# EAGLE design C2000 communications dock (EAGLE 9.5.0)
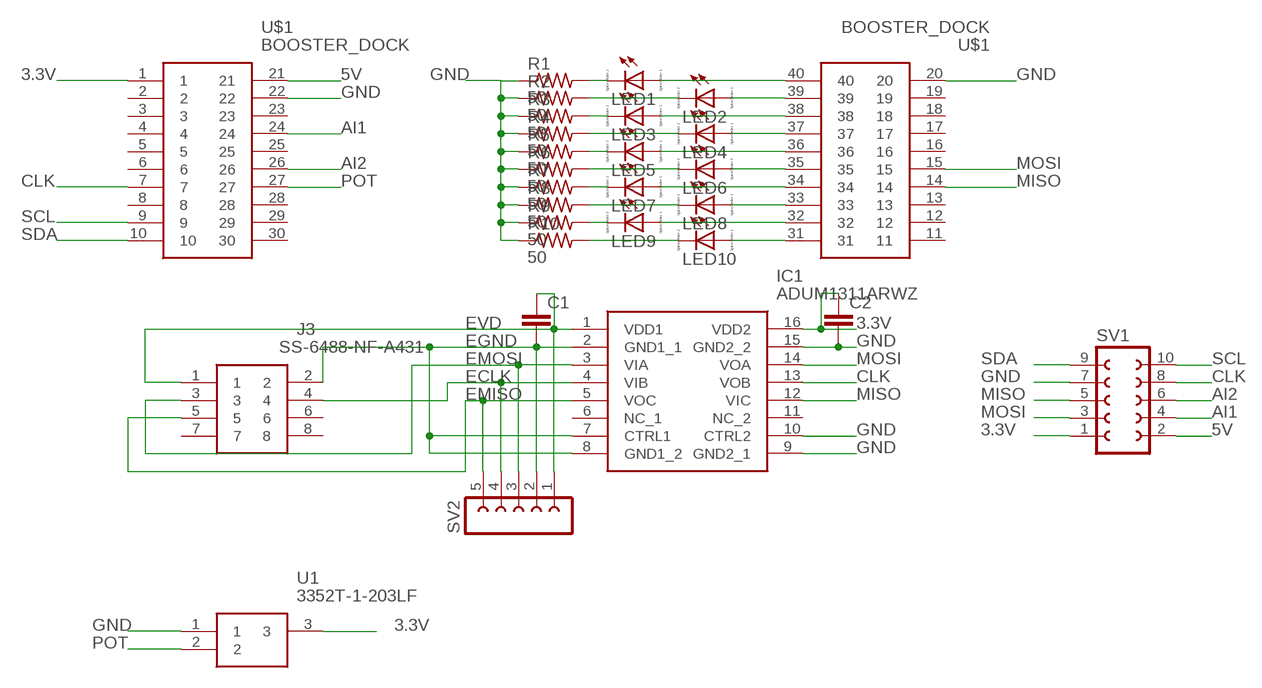
[diagram p0: schematic, sheet 1]

## Parts
C1  C-EUC0603  [C0603]
C2  C-EUC0603  [C0603]
IC1  ADUM1311ARWZ  [SOIC127P1032X265-16N]
J3  SS-6488-NF-A431  [SS6488NFA431]
LED1  LED_ESML0603  [LED_SML0603]
LED2  LED_ESML0603  [LED_SML0603]
LED3  LED_ESML0603  [LED_SML0603]
LED4  LED_ESML0603  [LED_SML0603]
LED5  LED_ESML0603  [LED_SML0603]
LED6  LED_ESML0603  [LED_SML0603]
LED7  LED_ESML0603  [LED_SML0603]
LED8  LED_ESML0603  [LED_SML0603]
LED9  LED_ESML0603  [LED_SML0603]
LED10  LED_ESML0603  [LED_SML0603]
R1  50  R-US_R0603  [R0603]
R2  50  R-US_R0603  [R0603]
R3  50  R-US_R0603  [R0603]
R4  50  R-US_R0603  [R0603]
R5  50  R-US_R0603  [R0603]
R6  50  R-US_R0603  [R0603]
R7  50  R-US_R0603  [R0603]
R8  50  R-US_R0603  [R0603]
R9  50  R-US_R0603  [R0603]
R10  50  R-US_R0603  [R0603]
SV1  FE05-2  [FE05-2]
SV2  FE05-1  [FE05-1]
U1  3352T-1-203LF  [3352T-1-203LF]
U$1  BOOSTER_DOCK  [BOOSTER_DOCK]

## Nets
3.3V: C2.1 IC1.16(VDD2) SV1.1 U1.3 U$1.1
5V: SV1.2 U$1.21
AI1: SV1.4 U$1.24
AI2: SV1.6 U$1.26
CLK: IC1.13(VOB) SV1.8 U$1.7
ECLK: IC1.4(VIB) J3.4 SV2.4
EGND: C1.2 IC1.2(GND1_1) IC1.7(CTRL1) IC1.8(GND1_2) J3.2 SV2.2
EMISO: IC1.5(VOC) J3.5 SV2.5
EMOSI: IC1.3(VIA) J3.3 SV2.3
EVD: C1.1 IC1.1(VDD1) J3.1 SV2.1
GND: C2.2 IC1.9(GND2_1) IC1.10(CTRL2) IC1.15(GND2_2) R1.1 R2.1 R3.1 R4.1 R5.1 R6.1 R7.1 R8.1 R9.1 R10.1 SV1.7 U1.1 U$1.20 U$1.22
MISO: IC1.12(VIC) SV1.5 U$1.14
MOSI: IC1.14(VOA) SV1.3 U$1.15
N$2: LED1.A U$1.40
N$3: LED2.A U$1.39
N$4: LED3.A U$1.38
N$5: LED4.A U$1.37
N$6: LED5.A U$1.36
N$8: LED6.A U$1.35
N$9: LED7.A U$1.34
N$11: LED8.A U$1.33
N$12: LED9.A U$1.32
N$15: LED10.A U$1.31
N$17: LED1.C R1.2
N$18: LED2.C R2.2
N$19: LED3.C R3.2
N$20: LED4.C R4.2
N$21: LED5.C R5.2
N$22: LED6.C R6.2
N$23: LED7.C R7.2
N$24: LED8.C R8.2
N$25: LED9.C R9.2
N$26: LED10.C R10.2
POT: U1.2 U$1.27
SCL: SV1.10 U$1.9
SDA: SV1.9 U$1.10
Unconnected: IC1.6(NC_1) IC1.11(NC_2) J3.6 J3.7 J3.8 U$1.2 U$1.3 U$1.4 U$1.5 U$1.6 U$1.8 U$1.11 U$1.12 U$1.13 U$1.16 U$1.17 U$1.18 U$1.19 U$1.23 U$1.25 U$1.28 U$1.29 U$1.30

## Library data of the parts
C1 C2 = rcl:C-EU: CAPACITOR, European symbol; SPICEPREFIX: C
IC1 = SamacSys_Parts:ADUM1311ARWZ: Analog Devices ADUM1311ARWZ PCB SMT 3-channel Digital Isolator, 2500 Vrms, 16-Pin SOIC Source: Datasheet <https://componentsearchengine.com/Datasheets/1/ADUM1311ARWZ.pdf>; DESCRIPTION: Analog Devices ADUM1311ARWZ PCB SMT 3-channel Digital Isolator, 2500 Vrms, 16-Pin SOIC; HEIGHT: 2.65mm; MANUFACTURER_NAME: Analog Devices; MANUFACTURER_PART_NUMBER: ADUM1311ARWZ; MOUSER_PART_NUMBER: 584-ADUM1311ARWZ; MOUSER_PRICE-STOCK: https://www.mouser.com/Search/Refine.aspx?Keyword=584-ADUM1311ARWZ
J3 = SamacSys_Parts:SS-6488-NF-A431: Modular Connectors / Ethernet Connectors RJ45 Connector Source: Datasheet <https://www.mouser.pr/datasheet/2/643/dr-STW-SS-6488-NF-A431-1155183.pdf>; DESCRIPTION: Modular Connectors / Ethernet Connectors RJ45 Connector; HEIGHT: 12.82mm; MANUFACTURER_NAME: Bel; MANUFACTURER_PART_NUMBER: SS-6488-NF-A431; MOUSER_PART_NUMBER: 530-SS-6488-NF-A431
LED1-LED10 = eagle-ltspice:LED_E: LED Source: http://www.osram.convergy.de Source: www.luxeon.com Source: www.kingbright.com; SPICEMODEL: NONE; SPICEPREFIX: D; SPICETYPE: diode
R1-R10 = rcl:R-US_: RESISTOR, American symbol; SPICEPREFIX: R
SV1 = con-lsta:FE05-2: FEMALE HEADER; OC_FARNELL: unknown; OC_NEWARK: unknown
SV2 = con-lsta:FE05-1: FEMALE HEADER; OC_FARNELL: unknown; OC_NEWARK: unknown
U1 = SamacSys_Parts:3352T-1-203LF: BOURNS - 3352T-1-203LF - TRIMMER, POTENTIOMETER, 20KOHM 1TURN THRU HOLE Source: Datasheet <https://componentsearchengine.com/Datasheets/1/3352T-1-203LF.pdf>; DESCRIPTION: BOURNS - 3352T-1-203LF - TRIMMER, POTENTIOMETER, 20KOHM 1TURN THRU HOLE; HEIGHT: mm; MANUFACTURER_NAME: Bourns; MANUFACTURER_PART_NUMBER: 3352T-1-203LF; MOUSER_PART_NUMBER: 652-3352T-1-203LF; MOUSER_PRICE-STOCK: https://www.mouser.com/Search/Refine.aspx?Keyword=652-3352T-1-203LF
U$1 = REV BLDC:BOOSTER_DOCK

## Board
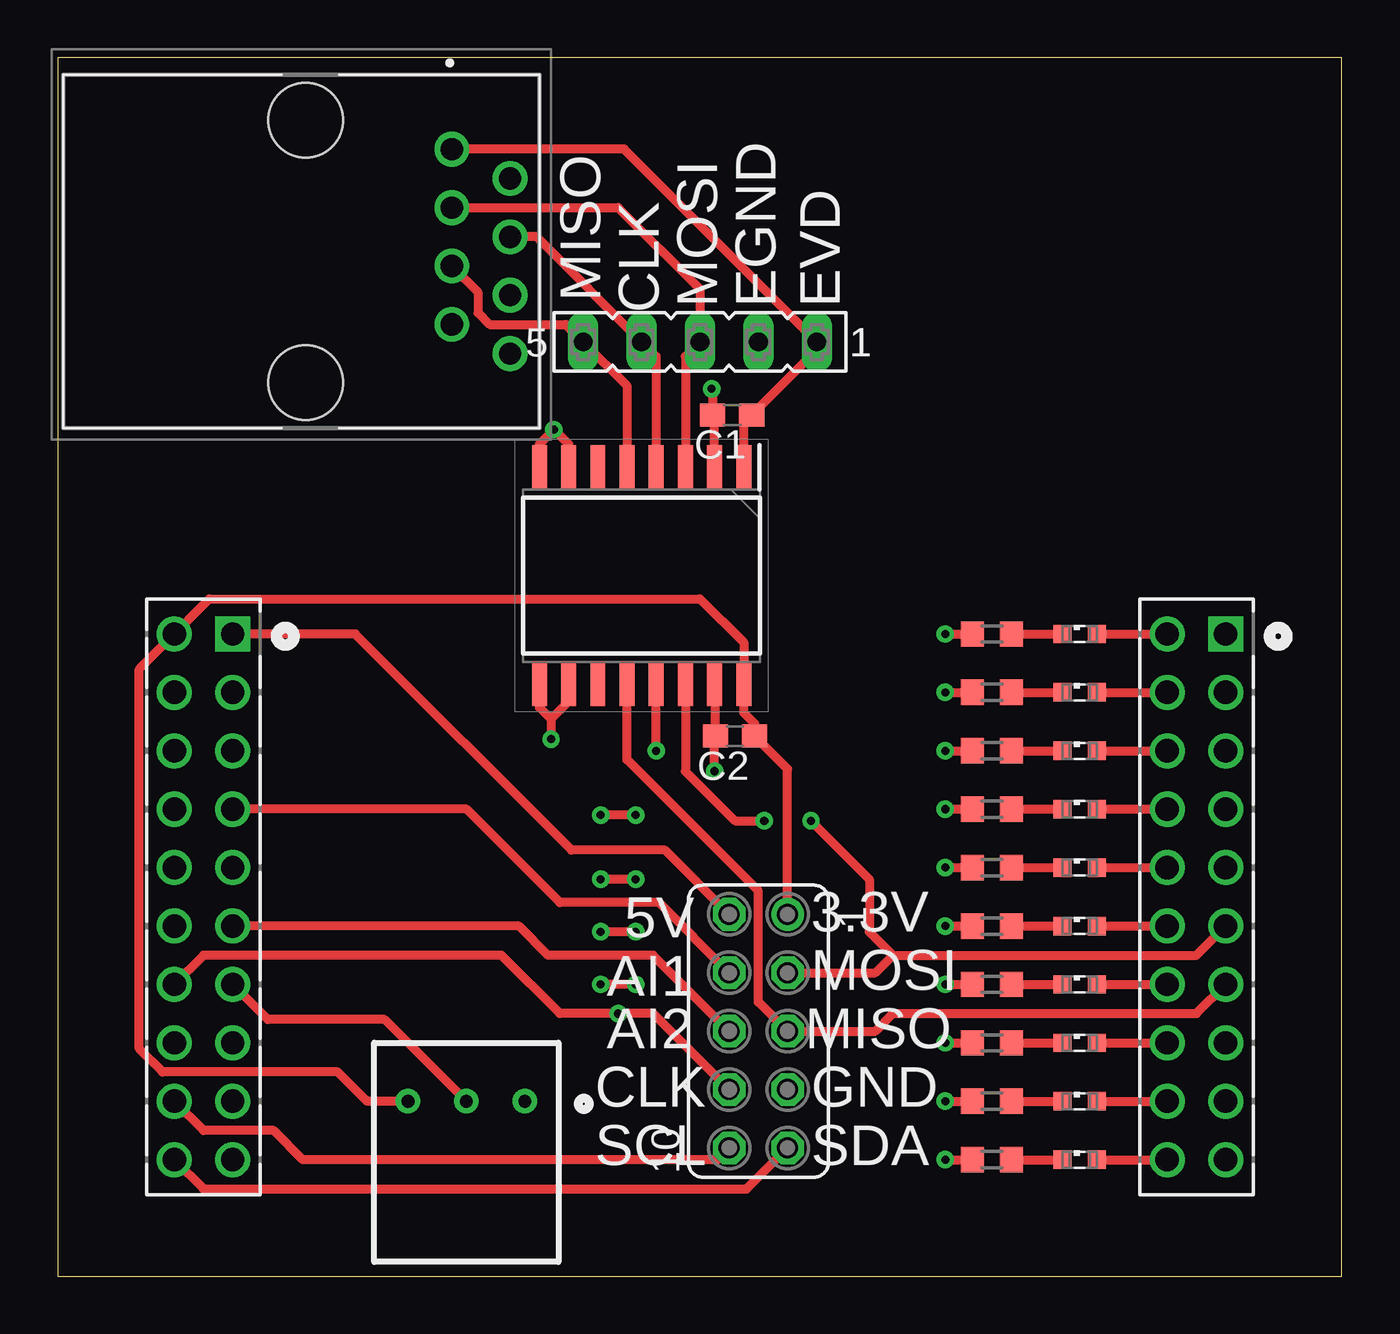
[diagram p1: board, top side]
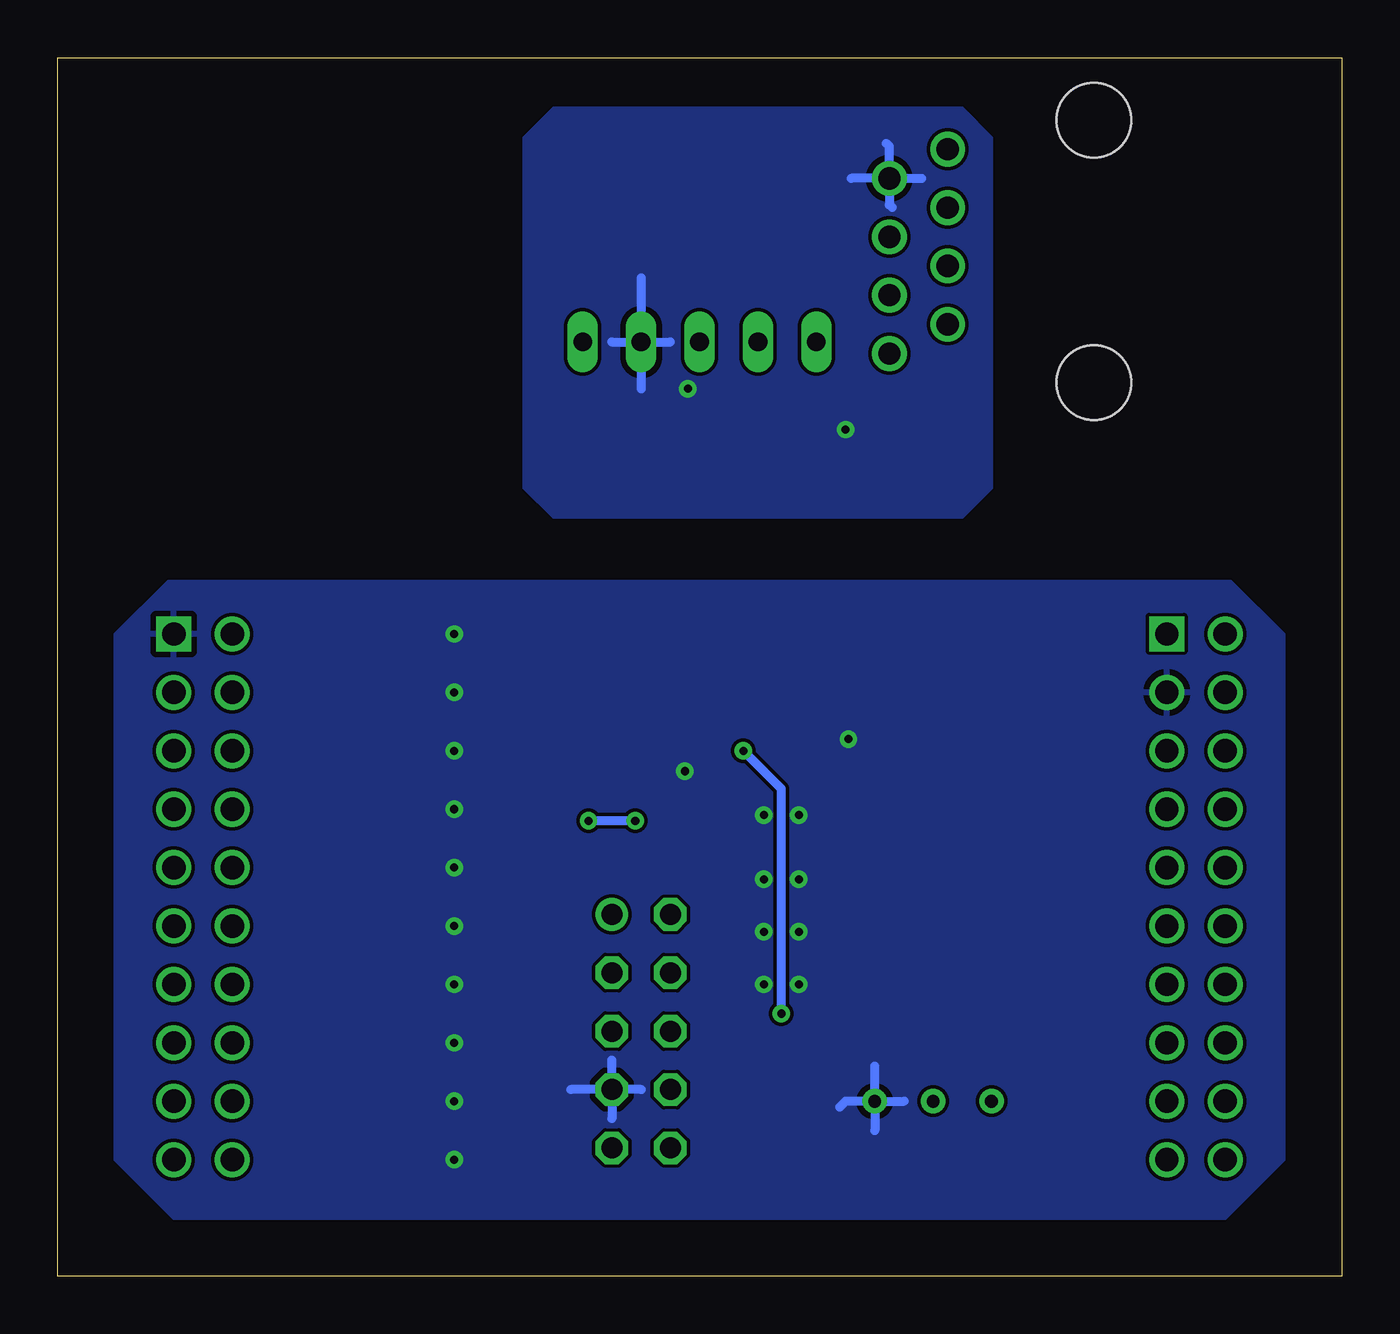
[diagram p2: board, bottom side, seen from below]

Size 55.86 x 53.01 mm. Coordinates in mm from the lower left corner, seen from the top.
Outline: 0,0 55.86,0 55.86,53.01 0,53.01 0,0
Copper layers (1*16): Top 0.035mm / dielectric 1.5mm / Bottom 0.035mm
Design rules "default *": minimum track width 15mil, minimum drill 0.35mm, track to track 6mil, track to pad 6mil, pad to pad 6mil, via to via 6mil, smd to smd 6mil, copper to edge 40mil, drill to drill 6mil, minimum pad ring 10mil, minimum via ring 8mil, stop-mask expansion 4mil, vias tented up to drill 0mil, thermal gap 10mil

### Footprints (pad centres in the part's own frame; a part is rotated, then mirrored left to right if it is on the bottom)
C0603 = smd 1.1 x 1: 1 -0.85,0; 2 0.85,0
SOIC127P1032X265-16N = smd 1.925 x 0.65: 1 -4.712,4.445; 2 -4.712,3.175; 3 -4.712,1.905; 4 -4.712,0.635; 5 -4.712,-0.635; 6 -4.712,-1.905; 7 -4.712,-3.175; 8 -4.712,-4.445; 9 4.712,-4.445; 10 4.712,-3.175; 11 4.712,-1.905; 12 4.712,-0.635; 13 4.712,0.635; 14 4.712,1.905; 15 4.712,3.175; 16 4.712,4.445
SS6488NFA431 = drill 0.97 pad 1.509: 1 0,0; 2 1.27,2.54; 3 2.54,0; 4 3.81,2.54; 5 5.08,0; 6 6.35,2.54; 7 7.62,0; 8 8.89,2.54 | hole 3.25: -1.27,-6.35; 10.16,-6.35
LED_SML0603 = smd 0.8 x 0.8: A 0.75,0; C -0.75,0
R0603 = smd 1 x 1.1: 1 -0.85,0; 2 0.85,0
FE05-2 = drill 0.914: 1 -5.08,1.27 | drill 0.914 octagon: 2 -5.08,-1.27; 3 -2.54,1.27; 4 -2.54,-1.27; 5 0,1.27; 6 0,-1.27; 7 2.54,1.27; 8 2.54,-1.27; 9 5.08,1.27; 10 5.08,-1.27
FE05-1 = drill 0.813 long: 1 -5.08,0; 2 -2.54,0; 3 0,0; 4 2.54,0; 5 5.08,0
3352T-1-203LF = drill 0.56 pad 1.06: 1 -2.54,0; 2 0,0; 3 2.54,0
BOOSTER_DOCK = drill 1.016 pad 1.524: 1 -22.86,11.43; 2 -22.86,8.89; 3 -22.86,6.35; 4 -22.86,3.81; 5 -22.86,1.27; 6 -22.86,-1.27; 7 -22.86,-3.81; 8 -22.86,-6.35; 9 -22.86,-8.89; 10 -22.86,-11.43; 11 22.86,-11.43; 12 22.86,-8.89; 13 22.86,-6.35; 14 22.86,-3.81; 15 22.86,-1.27; 16 22.86,1.27; 17 22.86,3.81; 18 22.86,6.35; 19 22.86,8.89; 22 -20.32,8.89; 23 -20.32,6.35; 24 -20.32,3.81; 25 -20.32,1.27; 26 -20.32,-1.27; 27 -20.32,-3.81; 28 -20.32,-6.35; 29 -20.32,-8.89; 30 -20.32,-11.43; 31 20.32,-11.43; 32 20.32,-8.89; 33 20.32,-6.35; 34 20.32,-3.81; 35 20.32,-1.27; 36 20.32,1.27; 37 20.32,3.81; 38 20.32,6.35; 39 20.32,8.89; 40 20.32,11.43 | drill 1.016 pad 1.524 square: 20 22.86,11.43; 21 -20.32,11.43

### Placement (x,y rotation side)
C1  29.34,37.47 180 top
C2  29.46,23.5 180 top
IC1  25.4,30.48 270 top
J3  17.14,49.02 270 top
LED1  44.45,27.94 0 top
LED2  44.45,25.4 0 top
LED3  44.45,22.86 0 top
LED4  44.45,20.32 0 top
LED5  44.45,17.78 0 top
LED6  44.45,15.24 0 top
LED7  44.45,12.7 0 top
LED8  44.45,10.16 0 top
LED9  44.45,7.62 0 top
LED10  44.45,5.08 0 top
R1  40.64,27.94 0 top
R2  40.64,25.4 0 top
R3  40.64,22.86 0 top
R4  40.64,20.32 0 top
R5  40.64,17.78 0 top
R6  40.64,15.24 0 top
R7  40.64,12.7 0 top
R8  40.64,10.16 0 top
R9  40.64,7.62 0 top
R10  40.64,5.08 0 top
SV1  30.48,10.67 270 top
SV2  27.94,40.64 180 top
U1  17.78,7.62 180 top
U$1  27.94,16.51 0 top

### Tracks (layer width: path | path; a pad name or v marks a point on that pad's centre or on a via)
3.3V
  Top 0.381: SV1.1 31.75,22.06 C2.1 30.31,24.04 29.84,24.51 IC1.16 29.84,27.56 27.94,29.46 6.6,29.46 U$1.1 3.56,26.42 3.56,9.91 4.57,8.89 12.19,8.89 13.46,7.62 U1.3
5V
  Top 0.381: U$1.21 12.95,27.94 22.35,18.54 26.42,18.54 SV1.2
AI1
  Top 0.381: U$1.24 17.78,20.32 21.84,16.26 26.16,16.26 SV1.4
AI2
  Top 0.381: U$1.26 20.07,15.24 21.34,13.97 25.91,13.97 SV1.6
CLK  (via drill 0.35)
  Top 0.381: SV1.8 25.91,11.43 v24.38,11.43 21.84,11.43 19.3,13.97 6.35,13.97 U$1.7 | v26.04,22.86 IC1.13
  Bottom 0.381: v24.38,11.43 24.38,21.21 v26.04,22.86
ECLK
  Top 0.381: IC1.4 26.04,40.01 SV2.4 20.83,45.21 J3.4
EGND  (via drill 0.35)
  Top 0.381: IC1.2 28.57,37.38 C1.2 28.49,38.57 v28.45,38.61 | IC1.7 22.23,36.2 v21.59,36.83 20.95,36.2 IC1.8
  Bottom 0.381: 30.48,43.43 SV2.2 | 31.75,40.64 SV2.2 | SV2.2 30.48,38.61 | SV2.2 29.21,40.64 | J3.2 19.68,49.15 19.81,49.28 | J3.2 21.34,47.75 | J3.2 19.68,46.61 19.56,46.48 | J3.2 18.29,47.75
  pour Bottom: 22.86,50.8 16.51,50.8 15.24,49.53 15.24,34.29 16.51,33.02 34.29,33.02 35.56,34.29 35.56,49.53 34.29,50.8
EMISO
  Top 0.381: IC1.5 24.77,38.73 SV2.5 22.1,41.4 18.8,41.4 18.29,41.91 18.29,42.8 J3.5
EMOSI
  Top 0.381: J3.3 24.38,46.48 27.94,42.93 SV2.3 27.3,40.01 IC1.3
EVD
  Top 0.381: IC1.1 29.84,37.12 C1.1 33.02,40.3 SV2.1 24.64,49.02 J3.1
GND  (via drill 0.35)
  Top 0.381: 21.46,24.24 20.95,24.75 IC1.9 | 21.46,24.24 v21.46,23.37 | v28.57,21.97 28.57,23.46 C2.2 28.61,25.73 IC1.15 | IC1.10 22.23,25.01 21.46,24.24 | v38.61,5.08 R10.1 | v38.61,7.62 R9.1 | v38.61,10.16 R8.1 | v38.61,12.7 R7.1 | v38.61,15.24 R6.1 | v38.61,17.78 R5.1 | v38.61,20.32 R4.1 | v38.61,22.86 R3.1 | v38.61,25.4 R2.1 | v38.61,27.94 R1.1 | v25.15,20.07 v23.62,20.07 | v25.15,17.27 v23.62,17.27 | v25.15,14.99 v23.62,14.99 | v25.15,12.7 v23.62,12.7
  Bottom 0.381: 30.48,8.13 SV1.7 | SV1.7 31.75,6.86 | SV1.7 33.53,8.13 | SV1.7 31.75,9.4 | U1.1 21.59,7.62 21.84,7.37 | U1.1 20.32,9.14 | U1.1 19.05,7.62 | U1.1 20.32,6.35
  pour Bottom: 2.54,27.94 2.54,5.08 5.08,2.54 50.8,2.54 53.34,5.08 53.34,27.94 51.05,30.23 4.83,30.23
MISO
  Top 0.381: U$1.14 49.53,11.43 36.32,11.43 35.56,10.67 SV1.5 30.48,11.94 30.48,16.76 24.77,22.48 IC1.12
MOSI  (via drill 0.35)
  Top 0.381: SV1.3 35.56,13.21 36.32,13.97 | U$1.15 49.53,13.97 36.32,13.97 | IC1.14 27.3,21.97 29.46,19.81 v30.73,19.81 | v32.77,19.81 35.31,17.27 35.31,14.99 36.32,13.97
  Bottom 0.381: v30.73,19.81 v32.77,19.81
N$2
  Top 0.381: LED1.A U$1.40
N$3
  Top 0.381: LED2.A U$1.39
N$4
  Top 0.381: LED3.A U$1.38
N$5
  Top 0.381: LED4.A U$1.37
N$6
  Top 0.381: LED5.A U$1.36
N$8
  Top 0.381: LED6.A U$1.35
N$9
  Top 0.381: LED7.A U$1.34
N$11
  Top 0.381: LED8.A U$1.33
N$12
  Top 0.381: LED9.A U$1.32
N$15
  Top 0.381: LED10.A U$1.31
N$17
  Top 0.381: R1.2 LED1.C
N$18
  Top 0.381: R2.2 LED2.C
N$19
  Top 0.381: R3.2 LED3.C
N$20
  Top 0.381: R4.2 LED4.C
N$21
  Top 0.381: R5.2 LED5.C
N$22
  Top 0.381: R6.2 LED6.C
N$23
  Top 0.381: R7.2 LED7.C
N$24
  Top 0.381: R8.2 LED8.C
N$25
  Top 0.381: R9.2 LED9.C
N$26
  Top 0.381: R10.2 LED10.C
POT
  Top 0.381: U$1.27 9.14,11.18 14.22,11.18 U1.2
SCL
  Top 0.381: U$1.9 6.35,6.35 9.4,6.35 10.67,5.08 28.7,5.08 SV1.10
SDA
  Top 0.381: U$1.10 6.35,3.81 29.97,3.81 SV1.9

### Text on the board
tNames: MISO | CLK | MOSI | EGND | EVD | 5V | 3.3V | AI1 | MOSI | AI2 | MISO | CLK | GND | SCL | SDA